# Altium schematic sheet BubbleSchem.SchDoc
size B; SheetNumber: 1; SheetTotal: 6; SPICEModelCacheDVQXQWHJ: <root> / <DocumentId>DVQXQWHJ</DocumentId> / <CacheFrame Number="0"> / <Model Name="led1" Kind="MDL"> / <Text>*Typ RED GaAs LED: Vf=1.7V Vr=4V If=40mA trr=3uS / *LED Pinout: 1=A, 2=K / .MODEL LED1 D (IS=93.2P RS=42M N=3.73 BV=4 IBV=10U / + CJO=2.97P VJ=.75 M=.333 TT=4.32U)</Text> / </Model> / </CacheFrame> / </root>
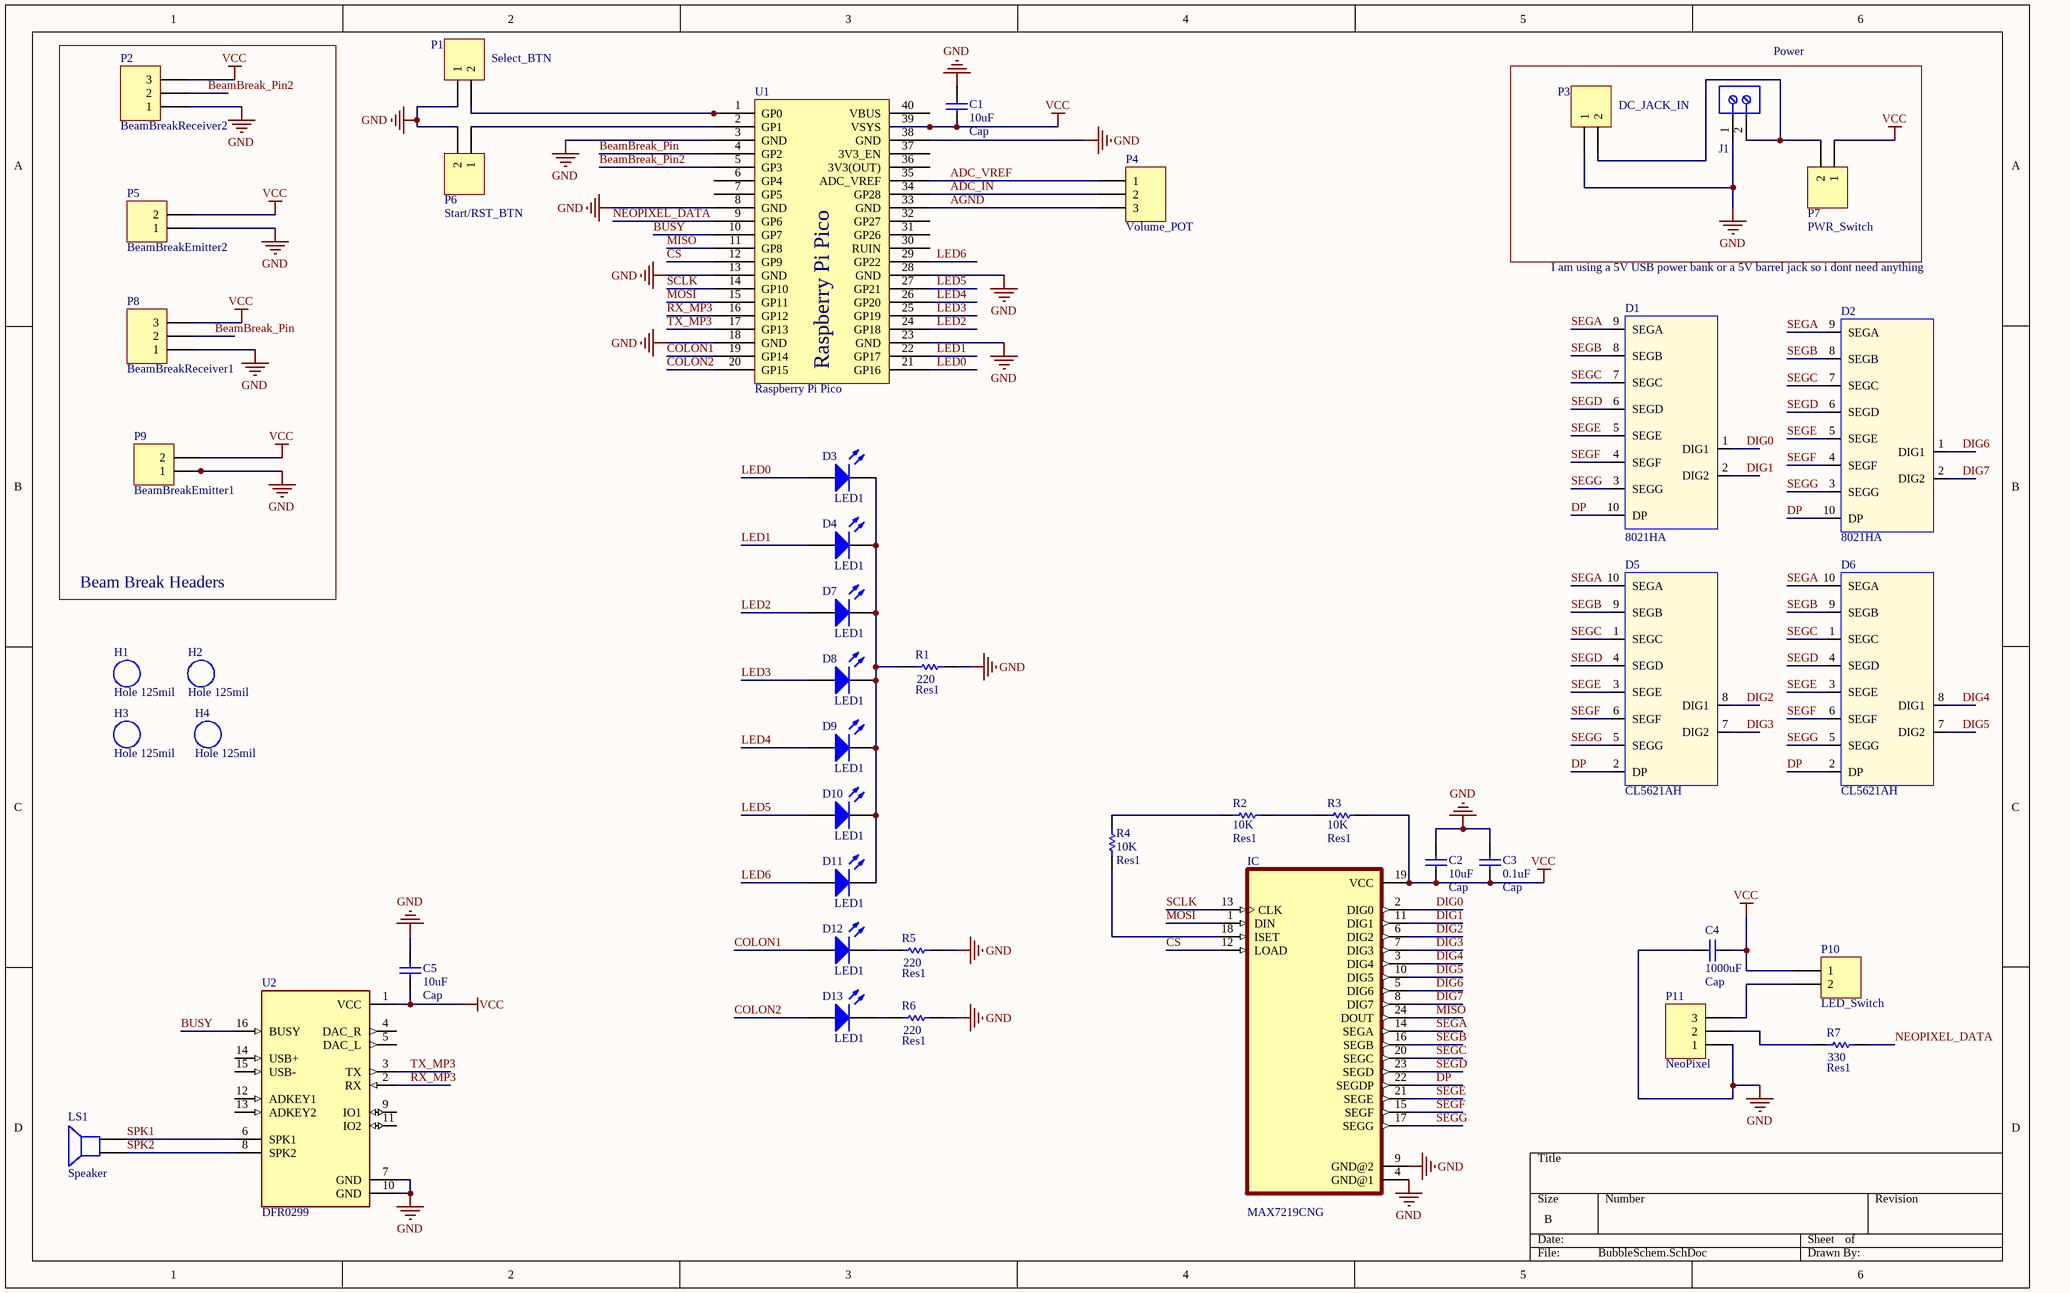
[diagram p0: BubbleSchem.SchDoc]

## Parts
C1  Cap  value 10uF  [RAD-0.3]
C2  Cap  value 10uF  [RAD-0.3]
C3  Cap  value 0.1uF  [RAD-0.3]
C4  Cap  value 1000uF  [RAD-0.3]
C5  Cap  value 10uF  [RAD-0.3]
D1  8021HA  [PCBComponent_1]
D2  8021HA  [PCBComponent_1]
D3  LED1  [LED]
D4  LED1  [LED]
D5  CL5621AH  [CL5621AH]
D6  CL5621AH  [CL5621AH]
D7  LED1  [LED]
D8  LED1  [LED]
D9  LED1  [LED]
D10  LED1  [LED]
D11  LED1  [LED]
D12  LED1  [LED]
D13  LED1  [LED]
H1  Hole 125mil  [Hole 125mil]
H2  Hole 125mil  [Hole 125mil]
H3  Hole 125mil  [Hole 125mil]
H4  Hole 125mil  [Hole 125mil]
IC  MAX7219CNG  [DIP794W47P254L3213H457Q24]
J1  691137710002  [691137710002]  (value not drawn)
LS1  Speaker  [PIN2]
P1  Select_BTN  [HDR1X2]
P2  BeamBreakReceiver2  [HDR1X3]
P3  DC_JACK_IN  [HDR1X2]
P4  Volume_POT  [HDR1X3]
P5  BeamBreakEmitter2  [HDR1X2]
P6  Start/RST_BTN  [HDR1X2]
P7  PWR_Switch  [HDR1X2]
P8  BeamBreakReceiver1  [HDR1X3]
P9  BeamBreakEmitter1  [HDR1X2]
P10  LED_Switch  [HDR1X2]
P11  NeoPixel  [HDR1X3]
R1  Res1  value 220  [AXIAL-0.3]
R2  Res1  value 10K  [AXIAL-0.3]
R3  Res1  value 10K  [AXIAL-0.3]
R4  Res1  value 10K  [AXIAL-0.3]
R5  Res1  value 220  [AXIAL-0.3]
R6  Res1  value 220  [AXIAL-0.3]
R7  Res1  value 330  [AXIAL-0.3]
U1  Raspberry Pi Pico  [Raspberry Pi Pico]
U2  DFR0299  [MODULE_DFR0299]

## Blocks framed on the sheet
Beam Break Headers: P2 P5 P8 P9
Power: J1 P3 P7

## Nets
GND: C1.1 C2.2 C3.2 C4.2 C5.2 IC.4(GND@1) IC.9(GND@2) J1.1 P1.1 P2.1 P3.1 P5.1 P6.2 P8.1 P9.1 P11.1 R1.2 R5.2 R6.2 U1.3(GND) U1.8(GND) U1.13(GND) U1.18(GND) U1.23(GND) U1.28(GND) U1.38(GND) U2.7(GND) U2.10(GND)
VCC: C1.2 C2.1 C3.1 C4.1 C5.1 IC.19(VCC) P2.3 P5.2 P7.1 P8.3 P9.2 P10.1 R3.2 U1.39(VSYS) U2.1(VCC)
ADC_IN: P4.2 U1.34(GP28)
ADC_VREF: P4.1 U1.35(ADC_VREF)
AGND: P4.3 U1.33(GND)
BeamBreak_Pin: P8.2 U1.4(GP2)
BeamBreak_Pin2: P2.2 U1.5(GP3)
BUSY: U1.10(GP7) U2.16(BUSY)
COLON1: D12.1(A) U1.19(GP14)
COLON2: D13.1(A) U1.20(GP15)
CS: IC.12(LOAD) U1.12(GP9)
DIG0: D1.1(DIG1) IC.2(DIG0)
DIG1: D1.2(DIG2) IC.11(DIG1)
DIG2: D5.8(DIG1) IC.6(DIG2)
DIG3: D5.7(DIG2) IC.7(DIG3)
DIG4: D6.8(DIG1) IC.3(DIG4)
DIG5: D6.7(DIG2) IC.10(DIG5)
DIG6: D2.1(DIG1) IC.5(DIG6)
DIG7: D2.2(DIG2) IC.8(DIG7)
DP: D1.10(DP) D2.10(DP) D5.2(DP) D6.2(DP) IC.22(SEGDP)
LED0: D3.1(A) U1.21(GP16)
LED1: D4.1(A) U1.22(GP17)
LED2: D7.1(A) U1.24(GP18)
LED3: D8.1(A) U1.25(GP19)
LED4: D9.1(A) U1.26(GP20)
LED5: D10.1(A) U1.27(GP21)
LED6: D11.1(A) U1.29(GP22)
MISO: IC.24(DOUT) U1.11(GP8)
MOSI: IC.1(DIN) U1.15(GP11)
NEOPIXEL_DATA: R7.2 U1.9(GP6)
RX_MP3: U1.16(GP12) U2.2(RX)
SCLK: IC.13(CLK) U1.14(GP10)
SEGA: D1.9(SEGA) D2.9(SEGA) D5.10(SEGA) D6.10(SEGA) IC.14(SEGA)
SEGB: D1.8(SEGB) D2.8(SEGB) D5.9(SEGB) D6.9(SEGB) IC.16(SEGB)
SEGC: D1.7(SEGC) D2.7(SEGC) D5.1(SEGC) D6.1(SEGC) IC.20(SEGC)
SEGD: D1.6(SEGD) D2.6(SEGD) D5.4(SEGD) D6.4(SEGD) IC.23(SEGD)
SEGE: D1.5(SEGE) D2.5(SEGE) D5.3(SEGE) D6.3(SEGE) IC.21(SEGE)
SEGF: D1.4(SEGF) D2.4(SEGF) D5.6(SEGF) D6.6(SEGF) IC.15(SEGF)
SEGG: D1.3(SEGG) D2.3(SEGG) D5.5(SEGG) D6.5(SEGG) IC.17(SEGG)
SPK1: LS1.2 U2.6(SPK1)
SPK2: LS1.1 U2.8(SPK2)
TX_MP3: U1.17(GP13) U2.3(TX)
NetD3_2: D3.2(K) D4.2(K) D7.2(K) D8.2(K) D9.2(K) D10.2(K) D11.2(K) R1.1
NetD12_2: D12.2(K) R5.1
NetD13_2: D13.2(K) R6.1
NetIC_18: IC.18(ISET) R4.1
NetJ1_2: J1.2 P3.2 P7.2
NetP1_2: P1.2 U1.1(GP0)
NetP6_1: P6.1 U1.2(GP1)
NetP10_2: P10.2 P11.3
NetP11_2: P11.2 R7.1
NetR2_1: R2.1 R4.2
NetR2_2: R2.2 R3.1

Not connected (* = marked no-connect by the designer): U1 6(GP4) 7(GP5) 30(RUIN) 31(GP26) 32(GP27) 36(3V3(OUT)) 37(3V3_EN) 40(VBUS); U2 4(DAC_R) 5(DAC_L) 9(IO1) 11(IO2) 12(ADKEY1) 13(ADKEY2) 14(USB+) 15(USB-)

## Notes on the sheet
- I am using a 5V USB power bank or a 5V barrel jack so i dont need anything

## Library data of the parts
C1-C5 = Cap: Capacitor; Published: 8-Jun-2000; LatestRevisionDate: 17-Jul-2002; LatestRevisionNote: Re-released for DXP Platform.; PackageReference: RAD-0.3; Publisher: Altium Limited; PackageDescription: Radial Cap, Thru-Hole; 2 Leads; 0.3 in Pin Spacing
D1 D2 = 8021HA: 8021AH 7 Segment Display / 1.41"x1.02x0.39 / 35.8x25.8x14mm
D3 D4 D7-D13 = LED1: Typical RED GaAs LED; Published: 8-Jun-2000; LatestRevisionDate: 08-Jul-2005; LatestRevisionNote: Mech Layer 1 removed.; PackageReference: LED-1; Publisher: Altium Limited; PackageDescription: LED; 2 Leads
D5 D6 = CL5621AH: 7 Segment Display 0.56" / Case size 25mmx19x8; Manufacturer: XLITX TECHNOLOGY; Model Number: 5621AH
IC = MAX7219CNG: IC DRVR 7 SEGMENT 8 DIGIT 24DIP; MF: Maxim Integrated; DigiKey-Purchase-URL: https://snapeda.com/shop?store=DigiKey&id=1086587; SnapEDA_Link: https://www.snapeda.com/parts/MAX7219CNG/Maxim%20Integrated/view-part/1086587/?ref=snap; Availability: Warning; Price: None; Value: *; MP: MAX7219CNG; Package: DIP-24 Maxim Integrated
J1 = 691137710002: WR-TBL Series 1377 Horizontal Entry, THT, pitch 5mm, 2p; Manufacturer: Wurth Elektronik; Modularity: No; Rated Current: 16A; Working Voltage: 300V; ComponentLink1Description: Website Link; ComponentLink1URL: https://www.we-online.com/redexpert/article/691137710002?ad; ComponentLink2Description: Datasheet Link; ComponentLink2URL: https://www.we-online.com/redexpert/spec/691137710002?ad; Manufacturer Part Number: 691137710002; Category: Terminal Blocks; Match Code: WR-TBL; Mount: Through Hole; Operating Temperature Max: 120°C; Operating Temperature Min: -30°C; Packaging: Box; Application: Pressure Clamp; Number of Pins: 2; Number of Rows: 1; Orientation: Horizontal; Pitch: 5mm
LS1 = Speaker: Loudspeaker; Published: 24-Mar-1999; LatestRevisionDate: 17-Jul-2002; LatestRevisionNote: Re-released for DXP Platform.; PackageReference: PIN2; Publisher: Altium Limited
P1 P3 P5-P7 P9 P10 = Header 2H: Header, 2-Pin, Right Angle; LatestRevisionDate: 17-Jul-2002; LatestRevisionNote: Re-released for DXP Platform.; Publisher: Altium Limited
P2 P4 P8 P11 = Header 3: Header, 3-Pin; LatestRevisionDate: 17-Jul-2002; LatestRevisionNote: Re-released for DXP Platform.; Publisher: Altium Limited
R1-R7 = Res1: Resistor; Published: 8-Jun-2000; LatestRevisionDate: 17-Jul-2002; LatestRevisionNote: Re-released for DXP Platform.; PackageReference: AXIAL-0.3; Publisher: Altium Limited; PackageDescription: Axial Device, Thru-Hole; 2 Leads; 0.3 in Pin Spacing
U2 = DFR0299: - MP3 Player Audio Arduino Platform Evaluation Expansion Board; MF: DFRobot; SnapEDA_Link: https://www.snapeda.com/parts/DFR0299/DFRobot/view-part/?ref=snap; Package: None; Value: *; MP: DFR0299; Check_prices: https://www.snapeda.com/parts/DFR0299/DFRobot/view-part/?ref=eda